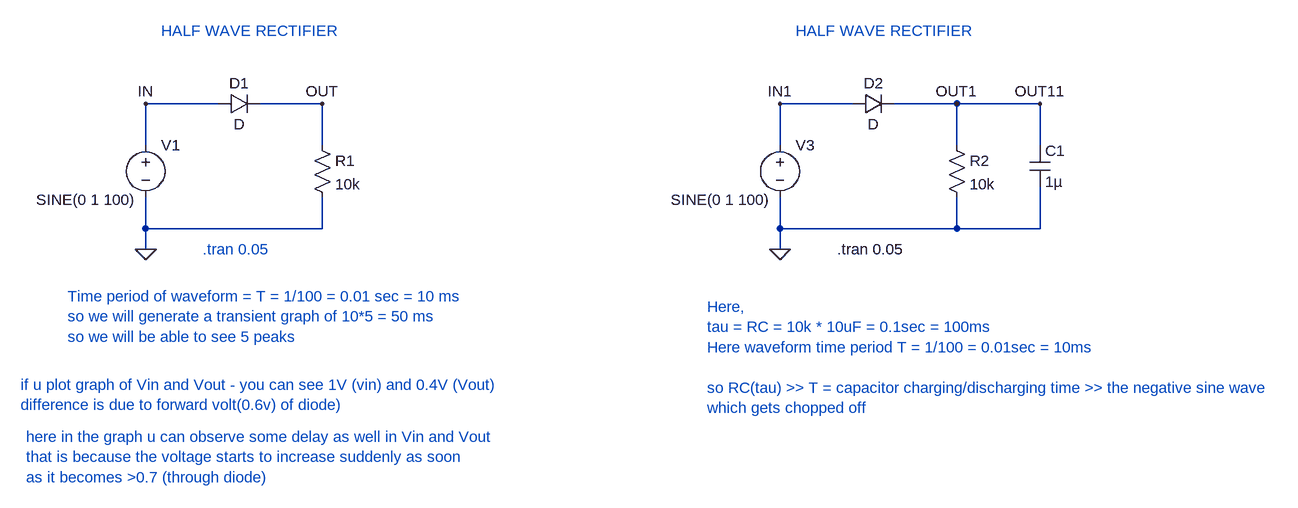
[diagram p0: schematic Half_wave_rectifier.asc]
Half_wave_rectifier.asc, the LTspice schematic file:
Version 4.1
SHEET 1 1884 680
WIRE 160 32 48 32
WIRE 320 32 224 32
WIRE 1136 32 1024 32
WIRE 1296 32 1200 32
WIRE 1424 32 1296 32
WIRE 48 96 48 32
WIRE 320 96 320 32
WIRE 1024 96 1024 32
WIRE 1296 96 1296 32
WIRE 1424 96 1424 32
WIRE 48 224 48 176
WIRE 320 224 320 176
WIRE 320 224 48 224
WIRE 1024 224 1024 176
WIRE 1296 224 1296 176
WIRE 1296 224 1024 224
WIRE 1424 224 1424 160
WIRE 1424 224 1296 224
WIRE 48 256 48 224
WIRE 1024 256 1024 224
FLAG 48 256 0
FLAG 48 32 IN
FLAG 320 32 OUT
FLAG 1024 256 0
FLAG 1024 32 IN1
FLAG 1296 32 OUT1
FLAG 1424 32 OUT11
SYMBOL voltage 48 80 R0
WINDOW 3 -168 100 Left 2
WINDOW 123 0 0 Left 0
WINDOW 39 0 0 Left 0
SYMATTR Value SINE(0 1 100)
SYMATTR InstName V1
SYMBOL res 304 80 R0
SYMATTR InstName R1
SYMATTR Value 10k
SYMBOL diode 160 48 R270
WINDOW 0 32 32 VTop 2
WINDOW 3 0 32 VBottom 2
SYMATTR InstName D1
SYMBOL voltage 1024 80 R0
WINDOW 3 -168 100 Left 2
WINDOW 123 0 0 Left 0
WINDOW 39 0 0 Left 0
SYMATTR Value SINE(0 1 100)
SYMATTR InstName V3
SYMBOL res 1280 80 R0
SYMATTR InstName R2
SYMATTR Value 10k
SYMBOL diode 1136 48 R270
WINDOW 0 32 32 VTop 2
WINDOW 3 0 32 VBottom 2
SYMATTR InstName D2
SYMBOL cap 1408 96 R0
SYMATTR InstName C1
SYMATTR Value 1µ
TEXT 72 -80 Left 2 ;HALF WAVE RECTIFIER
TEXT -72 328 Left 2 ;Time period of waveform = T = 1/100 = 0.01 sec = 10 ms\nso we will generate a transient graph of 10*5 = 50 ms \nso we will be able to see 5 peaks
TEXT 136 256 Left 2 ;.tran 0.05
TEXT -144 464 Left 2 ;if u plot graph of Vin and Vout - you can see 1V (vin) and 0.4V (Vout)\ndifference is due to forward volt(0.6v) of diode)
TEXT -136 544 Left 2 ;here in the graph u can observe some delay as well in Vin and Vout\nthat is because the voltage starts to increase suddenly as soon\nas it becomes >0.7 (through diode)
TEXT 1048 -80 Left 2 ;HALF WAVE RECTIFIER
TEXT 1112 256 Left 2 !.tran 0.05
TEXT 912 344 Left 2 ;Here,\ntau = RC = 10k * 10uF = 0.1sec = 100ms\nHere waveform time period T = 1/100 = 0.01sec = 10ms\n \nso RC(tau) >> T = capacitor charging/discharging time >> the negative sine wave \nwhich gets chopped off

The netlist it stands for:
* Half_wave_rectifier.asc
V1 IN 0 SINE(0 1 100)
R1 OUT 0 10k
D1 IN OUT D
V3 IN1 0 SINE(0 1 100)
R2 OUT11 0 10k
D2 IN1 OUT11 D
C1 OUT11 0 1µ
.model D D
.lib standard.dio
* HALF WAVE RECTIFIER
* Time period of waveform = T = 1/100 = 0.01 sec = 10 ms
* so we will generate a transient graph of 10*5 = 50 ms
* so we will be able to see 5 peaks
* .tran 0.05
* if u plot graph of Vin and Vout - you can see 1V (vin) and 0.4V (Vout)
* difference is due to forward volt(0.6v) of diode)
* here in the graph u can observe some delay as well in Vin and Vout
* that is because the voltage starts to increase suddenly as soon
* as it becomes >0.7 (through diode)
* HALF WAVE RECTIFIER
.tran 0.05
* Here,
* tau = RC = 10k * 10uF = 0.1sec = 100ms
* Here waveform time period T = 1/100 = 0.01sec = 10ms
* so RC(tau) >> T = capacitor charging/discharging time >> the negative sine wave
* which gets chopped off
.backanno
.end

* Results of the author's LTspice run, read from the files saved beside the schematic
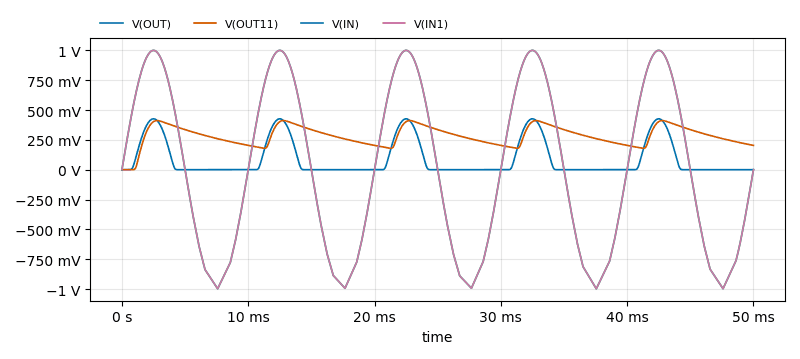
[diagram p1: Transient Analysis of Half_wave_rectifier.asc, plotted from the saved traces]
* Transient Analysis, 1 run:
*   V(OUT): min -1.33 µV, max 426.5 mV, average 90.41 mV, rms 173.9 mV, last 0 V
*   V(OUT11): min 0 V, max 411.5 mV, average 282.2 mV, rms 294.4 mV, last 203.5 mV
*   V(IN): min -998.2 mV, max 1 V, average 6.737 mV, rms 700.7 mV, last 0 V
*   V(IN1): min -998.2 mV, max 1 V, average 6.737 mV, rms 700.7 mV, last 0 V